# EasyEDA Pro project ProPrj_工训赛物料搬运主控_2025-03-02.epro, schematic 工训赛

## Sheets
1 主控无光耦
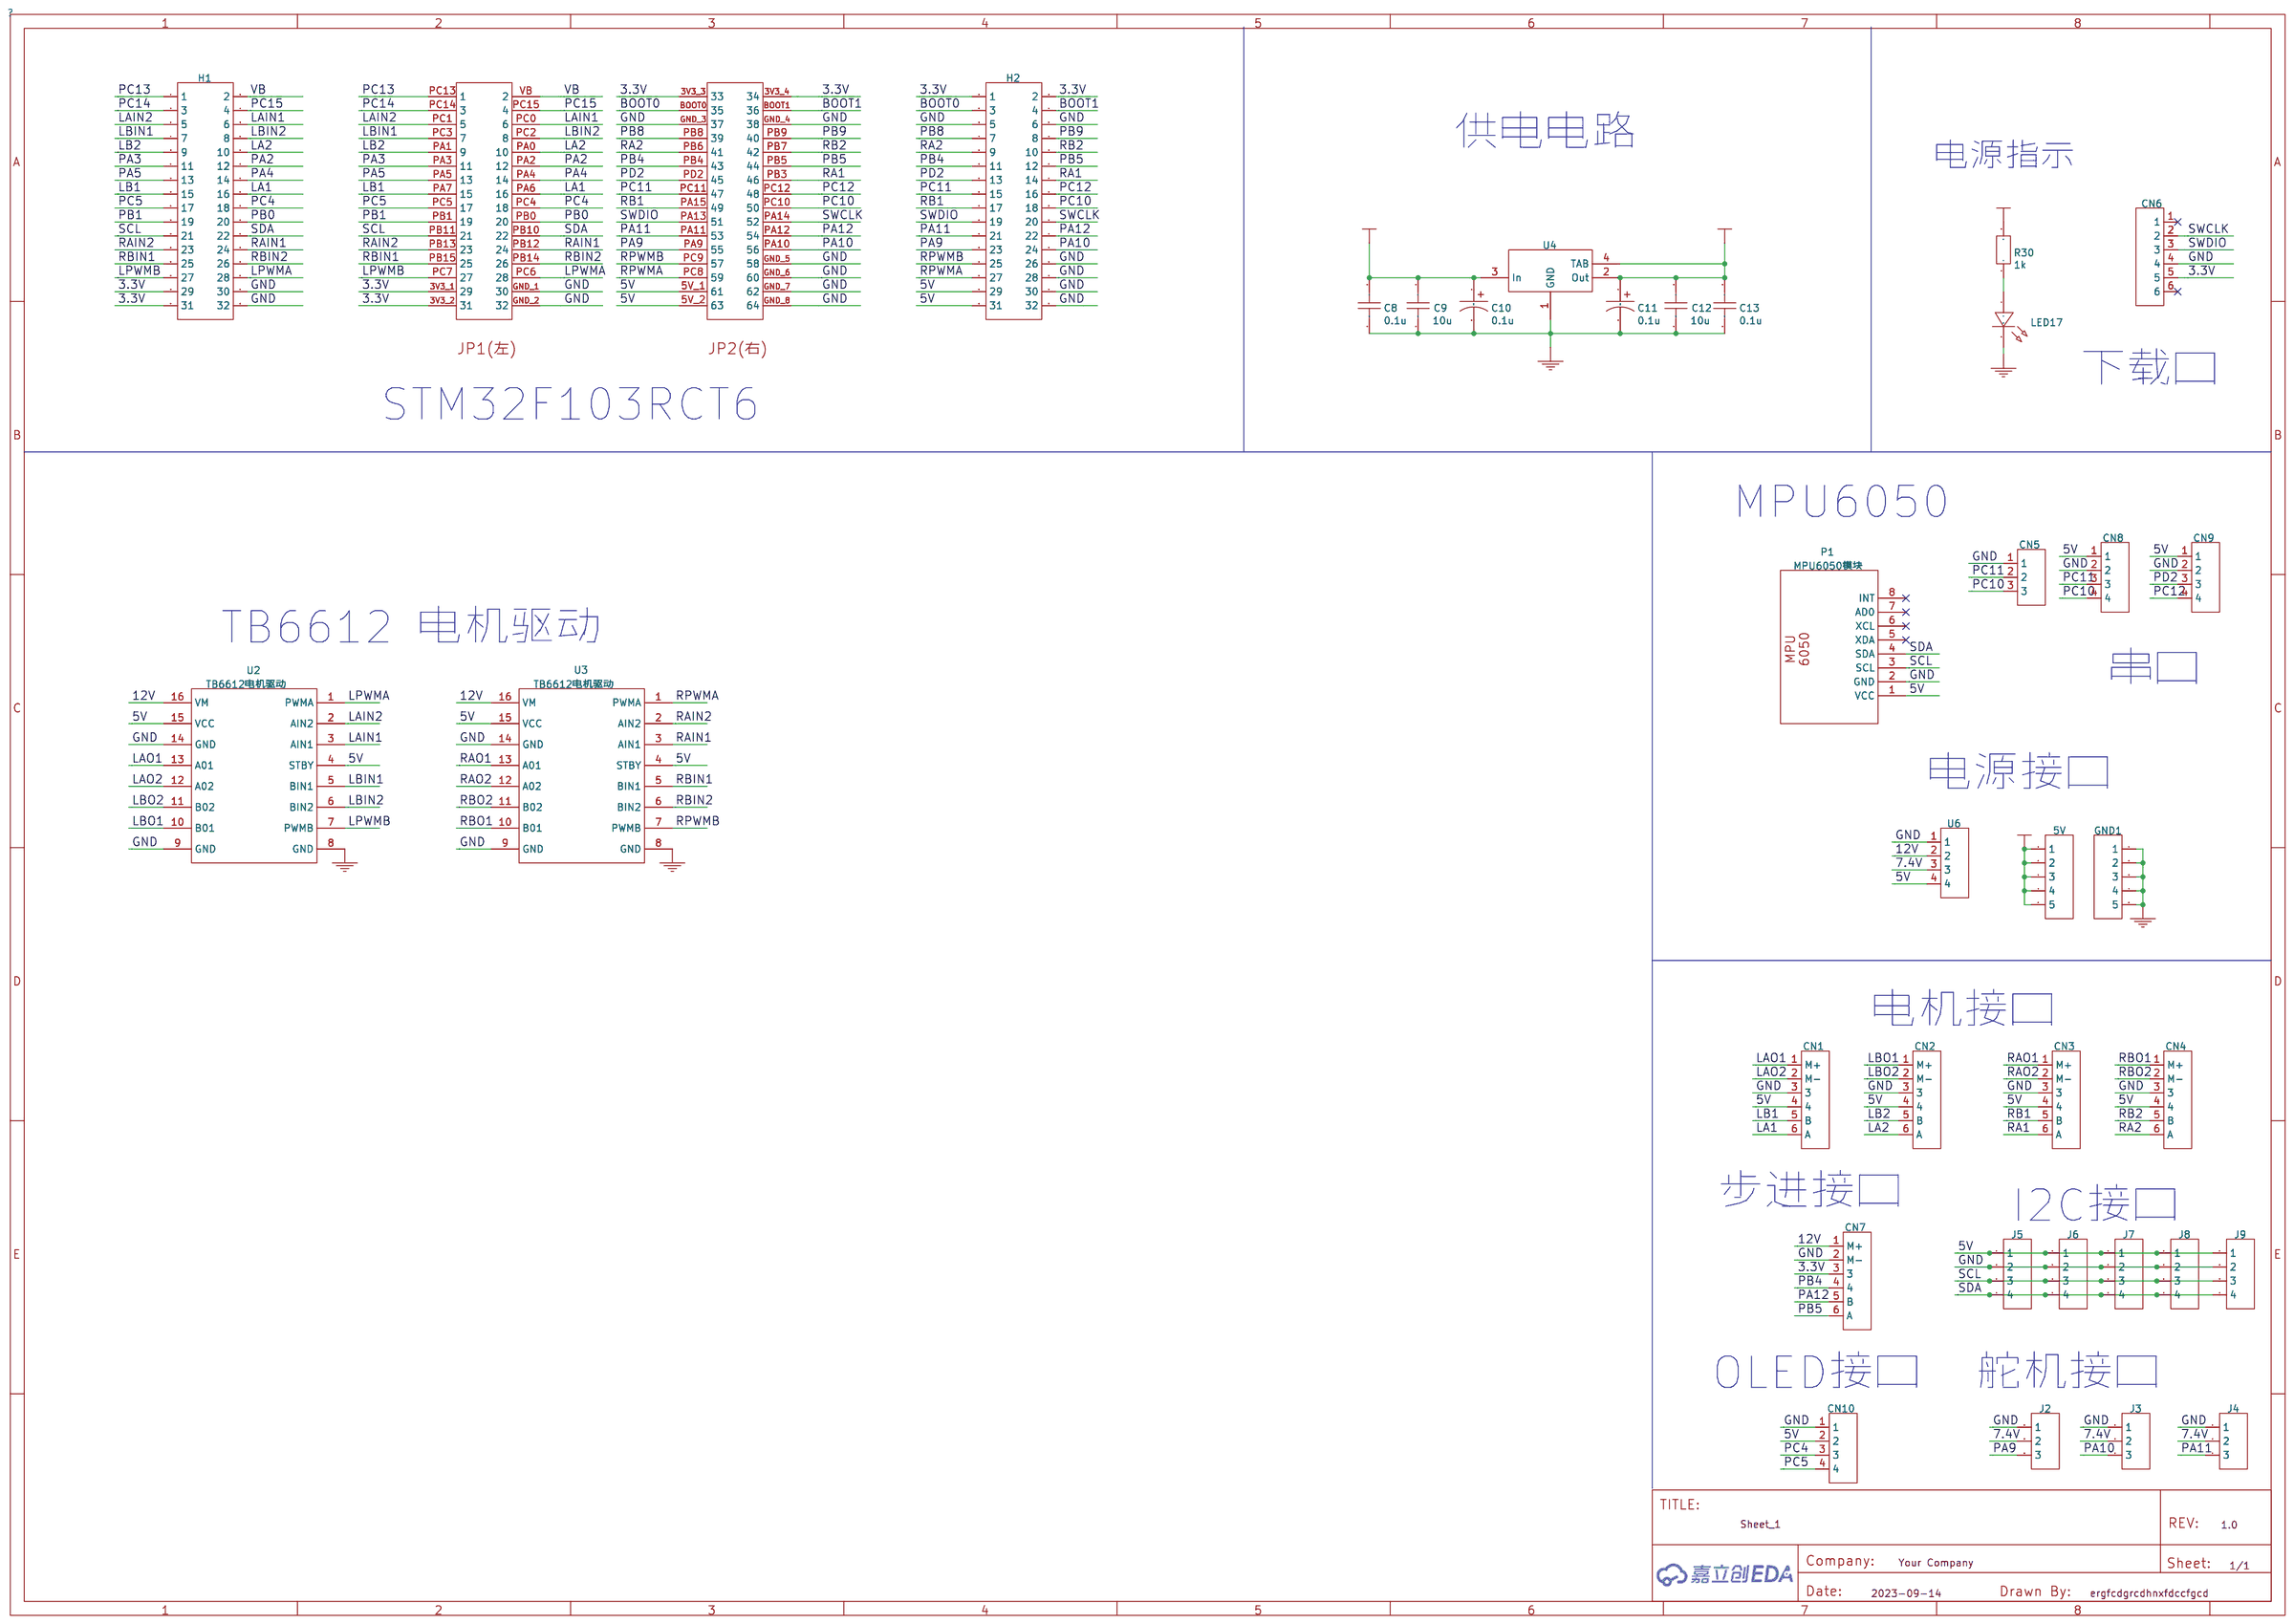
[diagram p0: 主控无光耦]
2 主控有光耦
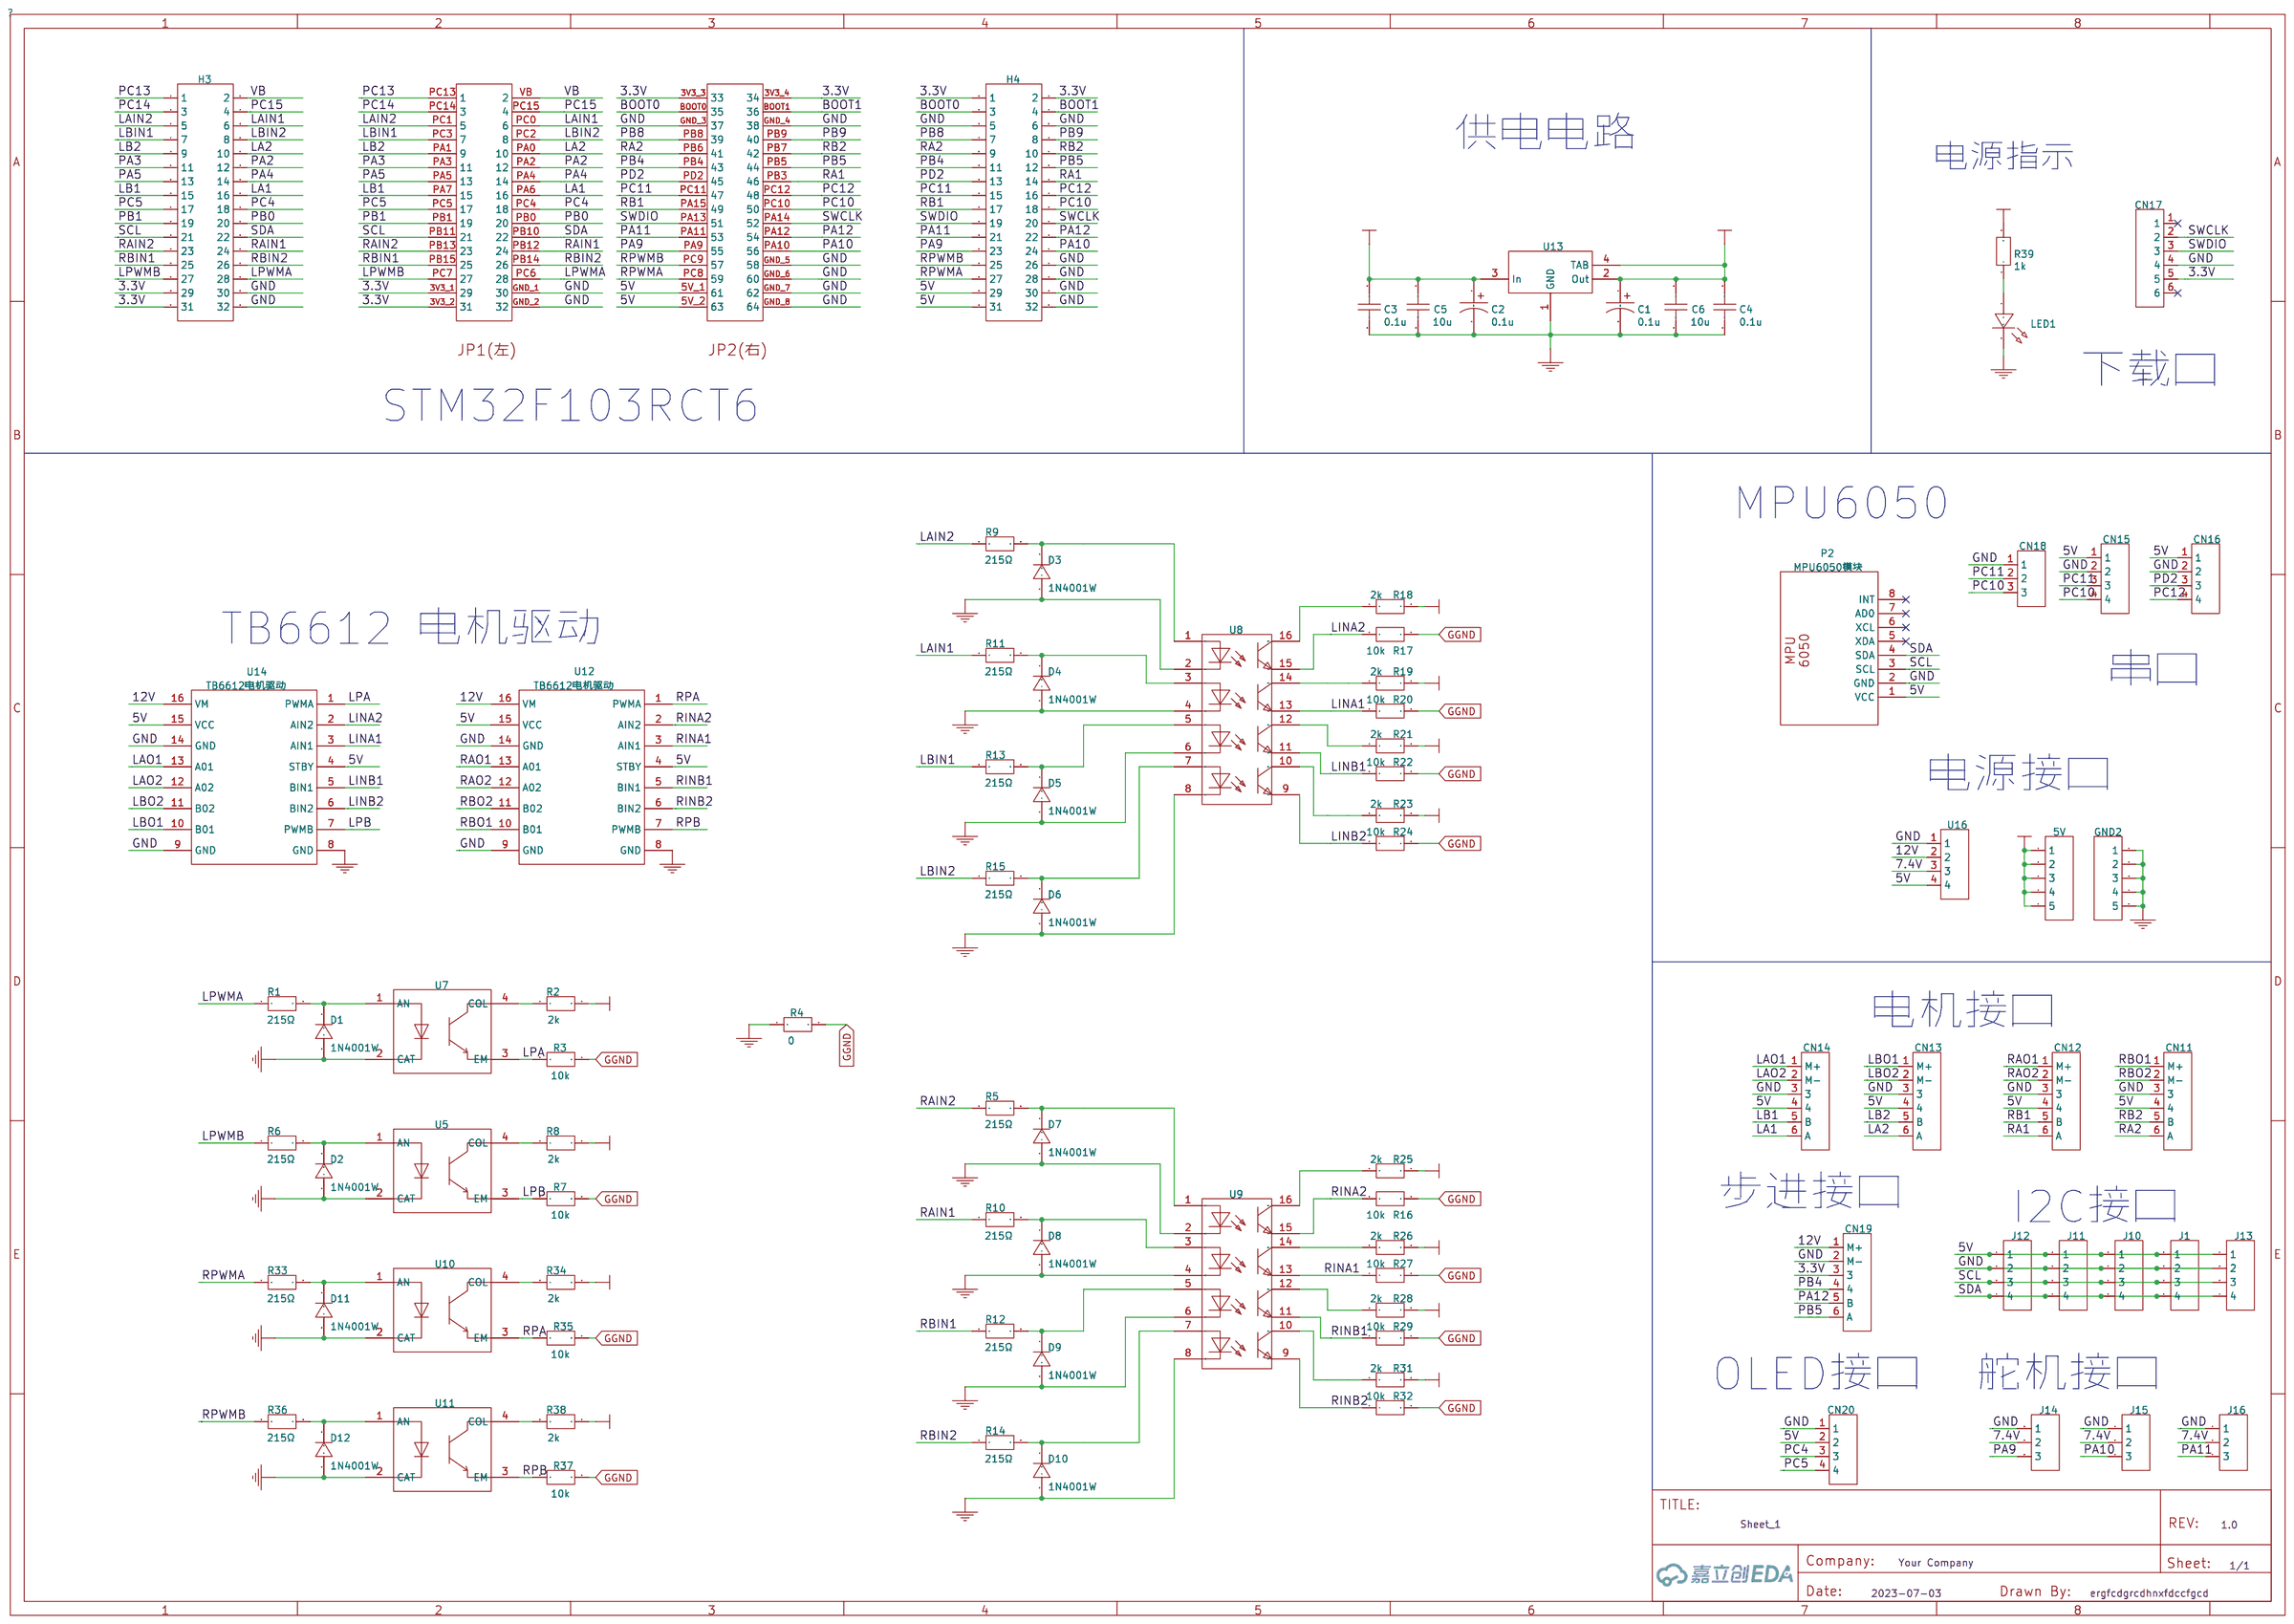
[diagram p1: 主控有光耦]
3 主控有光耦2.0
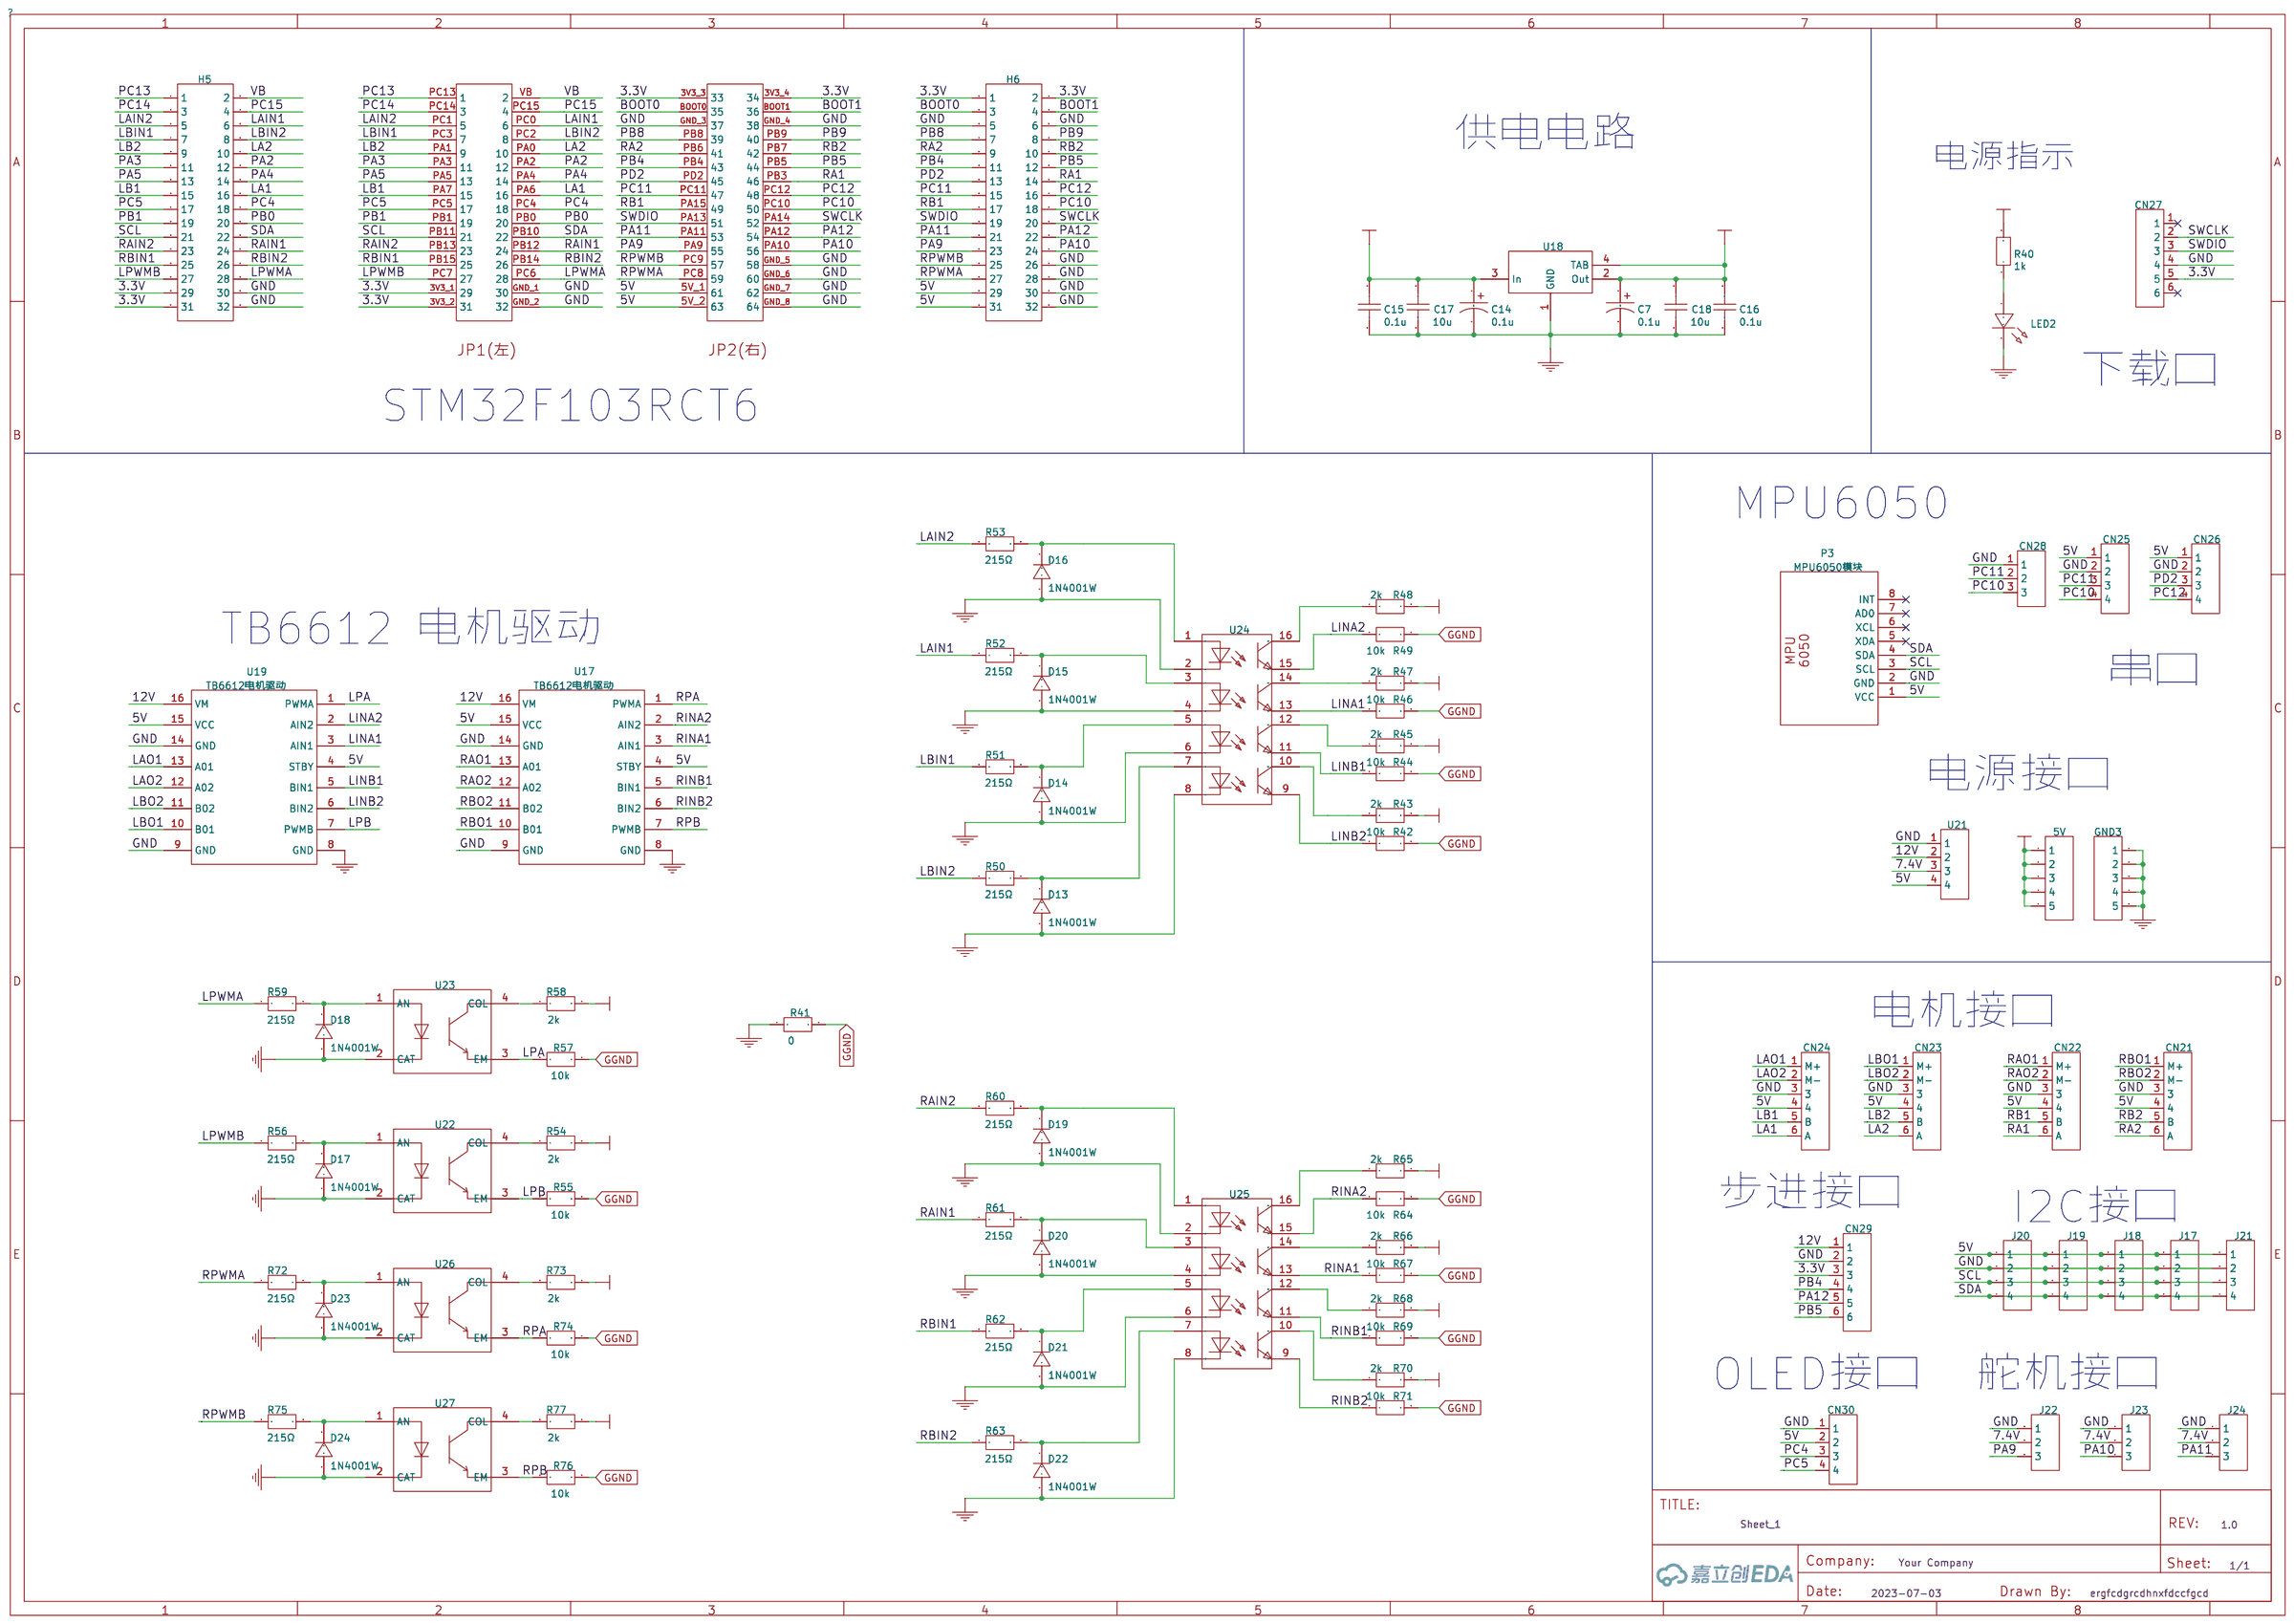
[diagram p2: 主控有光耦2.0]

## Parts
sheet 主控无光耦
5V  HDR-M-2.54_1x5  [HDR-M-2.54_1X5]
C8  0.1u  [C0805]
C9  10u  [C0805]
C10  0.1u  [CASE-A_3216]
C11  0.1u  [CASE-A_3216]
C12  10u  [C0805]
C13  0.1u  [C0805]
CN1  KH-PH-6P-W  [CONN-TH_6P-P2.00_KINGHELM_KH-PH-6P-W]
CN2  KH-PH-6P-W  [CONN-TH_6P-P2.00_KINGHELM_KH-PH-6P-W]
CN3  KH-PH-6P-W  [CONN-TH_6P-P2.00_KINGHELM_KH-PH-6P-W]
CN4  KH-PH-6P-W  [CONN-TH_6P-P2.00_KINGHELM_KH-PH-6P-W]
CN5  KH-PH-3P-Z  [CONN-TH_3P-P2.00_KINGHELM_KH-PH-3P-Z]
CN6  KH-PH-6P-W  [CONN-TH_6P-P2.00_KINGHELM_KH-PH-6P-W]
CN7  KH-PH-6P-W  [CONN-TH_6P-P2.00_KINGHELM_KH-PH-6P-W]
CN8  KH-PH-4P-Z  [CONN-TH_4P-P2.00_KINGHELM_KH-PH-4P-Z]
CN9  KH-PH-4P-Z  [CONN-TH_4P-P2.00_KINGHELM_KH-PH-4P-Z]
CN10  KH-PH-4P-W  [CONN-TH_4P-P2.00_KINGHELM_KH-PH-4P-W]
GND1  HDR-M-2.54_1x5  [HDR-M-2.54_1X5]
H1  HDR-F-2.54_2x16  [HDR-F-2.54_2X16]
H2  HDR-F-2.54_2x16  [HDR-F-2.54_2X16]
J2  HDR-M-2.54_1x3  [HDR-M-2.54_1X3]
J3  HDR-M-2.54_1x3  [HDR-M-2.54_1X3]
J4  HDR-M-2.54_1x3  [HDR-M-2.54_1X3]
J5  HDR-M-2.54_1x4  [HDR-M-2.54_1X4]
J6  HDR-M-2.54_1x4  [HDR-M-2.54_1X4]
J7  HDR-M-2.54_1x4  [HDR-M-2.54_1X4]
J8  HDR-M-2.54_1x4  [HDR-M-2.54_1X4]
J9  HDR-M-2.54_1x4  [HDR-M-2.54_1X4]
LED17  LED-0603_R  [LED0603_RED]
P1  MPU6050模块  [MPU6050模块]
R30  1k  [R0805]
U1  NO  [STM32F103RCT6最小系统]
U2  TB6612电机驱动  [TB6612电机驱动]
U3  TB6612电机驱动  [TB6612电机驱动]
U4  AMS1117-3.3  [SOT-223]
U6  DB125-2.54-4P-GN  [CONN-TH_DB125-2.54-4P-GN]
sheet 主控有光耦2.0
5V#3  HDR-M-2.54_1x5  [HDR-M-2.54_1X5]
C7  0.1u  [CASE-A_3216]
C14  0.1u  [CASE-A_3216]
C15  0.1u  [C0805]
C16  0.1u  [C0805]
C17  10u  [C0805]
C18  10u  [C0805]
CN21  KH-PH-6P-W  [CONN-TH_6P-P2.00_KINGHELM_KH-PH-6P-W]
CN22  KH-PH-6P-W  [CONN-TH_6P-P2.00_KINGHELM_KH-PH-6P-W]
CN23  KH-PH-6P-W  [CONN-TH_6P-P2.00_KINGHELM_KH-PH-6P-W]
CN24  KH-PH-6P-W  [CONN-TH_6P-P2.00_KINGHELM_KH-PH-6P-W]
CN25  KH-PH-4P-Z  [CONN-TH_4P-P2.00_KINGHELM_KH-PH-4P-Z]
CN26  KH-PH-4P-Z  [CONN-TH_4P-P2.00_KINGHELM_KH-PH-4P-Z]
CN27  KH-PH-6P-W  [CONN-TH_6P-P2.00_KINGHELM_KH-PH-6P-W]
CN28  KH-PH-3P-Z  [CONN-TH_3P-P2.00_KINGHELM_KH-PH-3P-Z]
CN29  KH-PH-6P-W  [CONN-TH_6P-P2.00_KINGHELM_KH-PH-6P-W]
CN30  KH-PH-4P-W  [CONN-TH_4P-P2.00_KINGHELM_KH-PH-4P-W]
D13  1N4001W  [SOD-123F_L2.8-W1.8-LS3.7-RD]
D14  1N4001W  [SOD-123F_L2.8-W1.8-LS3.7-RD]
D15  1N4001W  [SOD-123F_L2.8-W1.8-LS3.7-RD]
D16  1N4001W  [SOD-123F_L2.8-W1.8-LS3.7-RD]
D17  1N4001W  [SOD-123F_L2.8-W1.8-LS3.7-RD]
D18  1N4001W  [SOD-123F_L2.8-W1.8-LS3.7-RD]
D19  1N4001W  [SOD-123F_L2.8-W1.8-LS3.7-RD]
D20  1N4001W  [SOD-123F_L2.8-W1.8-LS3.7-RD]
D21  1N4001W  [SOD-123F_L2.8-W1.8-LS3.7-RD]
D22  1N4001W  [SOD-123F_L2.8-W1.8-LS3.7-RD]
D23  1N4001W  [SOD-123F_L2.8-W1.8-LS3.7-RD]
D24  1N4001W  [SOD-123F_L2.8-W1.8-LS3.7-RD]
GND3  HDR-M-2.54_1x5  [HDR-M-2.54_1X5]
H5  HDR-F-2.54_2x16  [HDR-F-2.54_2X16]
H6  HDR-F-2.54_2x16  [HDR-F-2.54_2X16]
J17  HDR-M-2.54_1x4  [HDR-M-2.54_1X4]
J18  HDR-M-2.54_1x4  [HDR-M-2.54_1X4]
J19  HDR-M-2.54_1x4  [HDR-M-2.54_1X4]
J20  HDR-M-2.54_1x4  [HDR-M-2.54_1X4]
J21  HDR-M-2.54_1x4  [HDR-M-2.54_1X4]
J22  HDR-M-2.54_1x3  [HDR-M-2.54_1X3]
J23  HDR-M-2.54_1x3  [HDR-M-2.54_1X3]
J24  HDR-M-2.54_1x3  [HDR-M-2.54_1X3]
LED2  LED-0603_R  [LED0603_RED]
P3  MPU6050模块  [MPU6050模块]
R40  1k  [R0805]
R41  0  [R0805]
R42  10k  [R0805]
R43  2k  [R0805]
R44  10k  [R0805]
R45  2k  [R0805]
R46  10k  [R0805]
R47  2k  [R0805]
R48  2k  [R0805]
R49  10k  [R0805]
R50  215Ω  [R0805]
R51  215Ω  [R0805]
R52  215Ω  [R0805]
R53  215Ω  [R0805]
R54  2k  [R0805]
R55  10k  [R0805]
R56  215Ω  [R0805]
R57  10k  [R0805]
R58  2k  [R0805]
R59  215Ω  [R0805]
R60  215Ω  [R0805]
R61  215Ω  [R0805]
R62  215Ω  [R0805]
R63  215Ω  [R0805]
R64  10k  [R0805]
R65  2k  [R0805]
R66  2k  [R0805]
R67  10k  [R0805]
R68  2k  [R0805]
R69  10k  [R0805]
R70  2k  [R0805]
R71  10k  [R0805]
R72  215Ω  [R0805]
R73  2k  [R0805]
R74  10k  [R0805]
R75  215Ω  [R0805]
R76  10k  [R0805]
R77  2k  [R0805]
U17  TB6612电机驱动  [TB6612电机驱动]
U18  AMS1117-3.3  [SOT-223]
U19  TB6612电机驱动  [TB6612电机驱动]
U20  NO  [STM32F103RCT6最小系统]
U21  DB125-2.54-4P-GN  [CONN-TH_DB125-2.54-4P-GN]
U22  TLP521-1XSM  [SMD-4_L4.6-W6.5-P2.54-LS10.2-BL]
U23  TLP521-1XSM  [SMD-4_L4.6-W6.5-P2.54-LS10.2-BL]
U24  TLP521-4XSM  [SMD-16_L20.0-W6.5-P2.54-LS10.2-BL]
U25  TLP521-4XSM  [SMD-16_L20.0-W6.5-P2.54-LS10.2-BL]
U26  TLP521-1XSM  [SMD-4_L4.6-W6.5-P2.54-LS10.2-BL]
U27  TLP521-1XSM  [SMD-4_L4.6-W6.5-P2.54-LS10.2-BL]
sheet 主控有光耦
5V#2  HDR-M-2.54_1x5  [HDR-M-2.54_1X5]
C1  0.1u  [CASE-A_3216]
C2  0.1u  [CASE-A_3216]
C3  0.1u  [C0805]
C4  0.1u  [C0805]
C5  10u  [C0805]
C6  10u  [C0805]
CN11  KH-PH-6P-W  [CONN-TH_6P-P2.00_KINGHELM_KH-PH-6P-W]
CN12  KH-PH-6P-W  [CONN-TH_6P-P2.00_KINGHELM_KH-PH-6P-W]
CN13  KH-PH-6P-W  [CONN-TH_6P-P2.00_KINGHELM_KH-PH-6P-W]
CN14  KH-PH-6P-W  [CONN-TH_6P-P2.00_KINGHELM_KH-PH-6P-W]
CN15  KH-PH-4P-Z  [CONN-TH_4P-P2.00_KINGHELM_KH-PH-4P-Z]
CN16  KH-PH-4P-Z  [CONN-TH_4P-P2.00_KINGHELM_KH-PH-4P-Z]
CN17  KH-PH-6P-W  [CONN-TH_6P-P2.00_KINGHELM_KH-PH-6P-W]
CN18  KH-PH-3P-Z  [CONN-TH_3P-P2.00_KINGHELM_KH-PH-3P-Z]
CN19  KH-PH-6P-W  [CONN-TH_6P-P2.00_KINGHELM_KH-PH-6P-W]
CN20  KH-PH-4P-W  [CONN-TH_4P-P2.00_KINGHELM_KH-PH-4P-W]
D1  1N4001W  [SOD-123F_L2.8-W1.8-LS3.7-RD]
D2  1N4001W  [SOD-123F_L2.8-W1.8-LS3.7-RD]
D3  1N4001W  [SOD-123F_L2.8-W1.8-LS3.7-RD]
D4  1N4001W  [SOD-123F_L2.8-W1.8-LS3.7-RD]
D5  1N4001W  [SOD-123F_L2.8-W1.8-LS3.7-RD]
D6  1N4001W  [SOD-123F_L2.8-W1.8-LS3.7-RD]
D7  1N4001W  [SOD-123F_L2.8-W1.8-LS3.7-RD]
D8  1N4001W  [SOD-123F_L2.8-W1.8-LS3.7-RD]
D9  1N4001W  [SOD-123F_L2.8-W1.8-LS3.7-RD]
D10  1N4001W  [SOD-123F_L2.8-W1.8-LS3.7-RD]
D11  1N4001W  [SOD-123F_L2.8-W1.8-LS3.7-RD]
D12  1N4001W  [SOD-123F_L2.8-W1.8-LS3.7-RD]
GND2  HDR-M-2.54_1x5  [HDR-M-2.54_1X5]
H3  HDR-F-2.54_2x16  [HDR-F-2.54_2X16]
H4  HDR-F-2.54_2x16  [HDR-F-2.54_2X16]
J1  HDR-M-2.54_1x4  [HDR-M-2.54_1X4]
J10  HDR-M-2.54_1x4  [HDR-M-2.54_1X4]
J11  HDR-M-2.54_1x4  [HDR-M-2.54_1X4]
J12  HDR-M-2.54_1x4  [HDR-M-2.54_1X4]
J13  HDR-M-2.54_1x4  [HDR-M-2.54_1X4]
J14  HDR-M-2.54_1x3  [HDR-M-2.54_1X3]
J15  HDR-M-2.54_1x3  [HDR-M-2.54_1X3]
J16  HDR-M-2.54_1x3  [HDR-M-2.54_1X3]
LED1  LED-0603_R  [LED0603_RED]
P2  MPU6050模块  [MPU6050模块]
R1  215Ω  [R0805]
R2  2k  [R0805]
R3  10k  [R0805]
R4  0  [R0805]
R5  215Ω  [R0805]
R6  215Ω  [R0805]
R7  10k  [R0805]
R8  2k  [R0805]
R9  215Ω  [R0805]
R10  215Ω  [R0805]
R11  215Ω  [R0805]
R12  215Ω  [R0805]
R13  215Ω  [R0805]
R14  215Ω  [R0805]
R15  215Ω  [R0805]
R16  10k  [R0805]
R17  10k  [R0805]
R18  2k  [R0805]
R19  2k  [R0805]
R20  10k  [R0805]
R21  2k  [R0805]
R22  10k  [R0805]
R23  2k  [R0805]
R24  10k  [R0805]
R25  2k  [R0805]
R26  2k  [R0805]
R27  10k  [R0805]
R28  2k  [R0805]
R29  10k  [R0805]
R31  2k  [R0805]
R32  10k  [R0805]
R33  215Ω  [R0805]
R34  2k  [R0805]
R35  10k  [R0805]
R36  215Ω  [R0805]
R37  10k  [R0805]
R38  2k  [R0805]
R39  1k  [R0805]
U5  TLP521-1XSM  [SMD-4_L4.6-W6.5-P2.54-LS10.2-BL]
U7  TLP521-1XSM  [SMD-4_L4.6-W6.5-P2.54-LS10.2-BL]
U8  TLP521-4XSM  [SMD-16_L20.0-W6.5-P2.54-LS10.2-BL]
U9  TLP521-4XSM  [SMD-16_L20.0-W6.5-P2.54-LS10.2-BL]
U10  TLP521-1XSM  [SMD-4_L4.6-W6.5-P2.54-LS10.2-BL]
U11  TLP521-1XSM  [SMD-4_L4.6-W6.5-P2.54-LS10.2-BL]
U12  TB6612电机驱动  [TB6612电机驱动]
U13  AMS1117-3.3  [SOT-223]
U14  TB6612电机驱动  [TB6612电机驱动]
U15  NO  [STM32F103RCT6最小系统]
U16  DB125-2.54-4P-GN  [CONN-TH_DB125-2.54-4P-GN]

## Library data of the parts
5V 5V#2 5V#3 GND1-GND3 = HDR-M-2.54_1x5: Supplier Part: C358687; Supplier: LCSC
C1-C4 C7 C8 C10 C11 C13-C16 = 0.1u
C5 C6 C9 C12 C17 C18 = 10u: Manufacturer Part: ?
CN1-CN4 CN11-CN14 CN21-CN24 = KH-PH-6P-W: Supplier: LCSC; Supplier Part: C2898958; Manufacturer: kinghelm(金航标); JLCPCB Part Class: Extended Part
CN5 CN18 CN28 = KH-PH-3P-Z: Supplier: LCSC; Supplier Part: C2898946; Manufacturer: kinghelm(金航标); JLCPCB Part Class: Extended Part; link: https://so.szlcsc.com/global.html?k=C2898946&ref=editor
CN6 CN7 CN17 CN19 CN27 CN29 = KH-PH-6P-W: Supplier: LCSC; Supplier Part: C2898958; Manufacturer: kinghelm(金航标); JLCPCB Part Class: Extended Part; link: https://so.szlcsc.com/global.html?k=C2898958&ref=editor
CN8 CN9 CN15 CN16 CN25 CN26 = KH-PH-4P-Z: Supplier: LCSC; Supplier Part: C2898947; Manufacturer: kinghelm(金航标); JLCPCB Part Class: Extended Part; link: https://so.szlcsc.com/global.html?k=C2898947&ref=editor
CN10 CN20 CN30 = KH-PH-4P-W: Supplier: LCSC; Supplier Part: C2898956; Manufacturer: kinghelm(金航标); JLCPCB Part Class: Extended Part; link: https://so.szlcsc.com/global.html?k=C2898956&ref=editor
H1-H6 = HDR-F-2.54_2x16: Supplier Part: C124382; Supplier: LCSC
J2-J4 J14-J16 J22-J24 = HDR-M-2.54_1x3: Supplier Part: C180248; Supplier: LCSC
J1 J5-J13 J17-J21 = HDR-M-2.54_1x4: Supplier Part: C124378; Supplier: LCSC
LED1 LED2 LED17 = LED-0603_R: Manufacturer: EVERLIGHT(台湾亿光); Manufacturer Part: 19-217/R6C-AL1M2VY/3T; Supplier Part: C72044; Supplier: LCSC
P1-P3 = MPU6050模块: Supplier: LCSC
R30 R39 R40 = 1k
U1 U15 U20 = NO: Manufacturer: 信泰微电子; Manufacturer Part: STM32F103RCT6; Supplier: 信泰微电子
U2 U3 U12 U14 U17 U19 = TB6612电机驱动: Supplier: LCSC
U4 U13 U18 = AMS1117-3.3: Supplier: LCSC; Manufacturer: AMS; image: //image.lceda.cn/szlcsc/C6186.jpg; Supplier Part: C6186
U6 U16 U21 = DB125-2.54-4P-GN: Supplier: LCSC; Supplier Part: C918122; Manufacturer: DIBO(地博电气); Manufacturer Part: DB125-2.54-4P-GN-S; JLCPCB Part Class: Extended Part; link: https://so.szlcsc.com/global.html?k=C918122&ref=editor
D1-D24 = 1N4001W: Supplier Part: C162732; Supplier: LCSC; Manufacturer: 晶导微电子; JLCPCB Part Class: Extended Part; link: https://so.szlcsc.com/global.html?k=C162732&ref=editor
R4 R41 = 0
R3 R7 R16 R17 R20 R22 R24 R27 R29 R32 R35 R37 R42 R44 R46 R49 R55 R57 R64 R67 R69 R71 R74 R76 = 10k
R2 R8 R18 R19 R21 R23 R25 R26 R28 R31 R34 R38 R43 R45 R47 R48 R54 R58 R65 R66 R68 R70 R73 R77 = 2k
R1 R5 R6 R9-R15 R33 R36 R50-R53 R56 R59-R63 R72 R75 = 215Ω
U5 U7 U10 U11 U22 U23 U26 U27 = TLP521-1XSM: Supplier: LCSC; Manufacturer: ISOCOM(英国安数光); Supplier Part: C83157; JLCPCB Part Class: Extended Part; link: https://so.szlcsc.com/global.html?k=C83157&ref=editor
U8 U9 U24 U25 = TLP521-4XSM: Supplier: LCSC; Manufacturer: ISOCOM(英国安数光); Manufacturer Part: TLP521-4XGBSM; Supplier Part: C83832; JLCPCB Part Class: Extended Part; link: https://so.szlcsc.com/global.html?k=C83832&ref=editor

## Nets
3.3V: C1.1 C4.2 C6.2 C7.1 C11.1 C12.2 C13.2 C16.2 C18.2 CN6.5 CN7.3 CN17.5 CN19.3 CN27.5 CN29.3 H1.29 H1.31 H2.1 H2.2 H3.29 H3.31 H4.1 H4.2 H5.29 H5.31 H6.1 H6.2 R30.2 R39.2 R40.2 U1.3V3_1(29) U1.3V3_2(31) U1.3V3_3(33) U1.3V3_4(34) U4.2(Out) U4.4(TAB) U13.2(Out) U13.4(TAB) U15.3V3_1(29) U15.3V3_2(31) U15.3V3_3(33) U15.3V3_4(34) U18.2(Out) U18.4(TAB) U20.3V3_1(29) U20.3V3_2(31) U20.3V3_3(33) U20.3V3_4(34)
5V: 5V.1 5V.2 5V.3 5V.4 5V.5 5V#2.1 5V#2.2 5V#2.3 5V#2.4 5V#2.5 5V#3.1 5V#3.2 5V#3.3 5V#3.4 5V#3.5 C2.1 C3.2 C5.2 C8.2 C9.2 C10.1 C14.1 C15.2 C17.2 CN1.4 CN2.4 CN3.4 CN4.4 CN8.1 CN9.1 CN10.2 CN11.4 CN12.4 CN13.4 CN14.4 CN15.1 CN16.1 CN20.2 CN21.4 CN22.4 CN23.4 CN24.4 CN25.1 CN26.1 CN30.2 H2.29 H2.31 H4.29 H4.31 H6.29 H6.31 J1.1 J5.1 J6.1 J7.1 J8.1 J9.1 J10.1 J11.1 J12.1 J13.1 J17.1 J18.1 J19.1 J20.1 J21.1 P1.1(VCC) P2.1(VCC) P3.1(VCC) R2.2 R8.2 R18.2 R19.2 R21.2 R23.2 R25.2 R26.2 R28.2 R31.2 R34.2 R38.2 R43.2 R45.2 R47.2 R48.2 R54.2 R58.2 R65.2 R66.2 R68.2 R70.2 R73.2 R77.2 U1.5V_1(61) U1.5V_2(63) U2.4(STBY) U2.15(VCC) U3.4(STBY) U3.15(VCC) U4.3(In) U6.4 U12.4(STBY) U12.15(VCC) U13.3(In) U14.4(STBY) U14.15(VCC) U15.5V_1(61) U15.5V_2(63) U16.4 U17.4(STBY) U17.15(VCC) U18.3(In) U19.4(STBY) U19.15(VCC) U20.5V_1(61) U20.5V_2(63) U21.4
7.4V: J2.2 J3.2 J4.2 J14.2 J15.2 J16.2 J22.2 J23.2 J24.2 U6.3 U16.3 U21.3
12V: CN7.1 CN19.1 CN29.1 U2.16(VM) U3.16(VM) U6.2 U12.16(VM) U14.16(VM) U16.2 U17.16(VM) U19.16(VM) U21.2
GND: C1.2 C2.2 C3.1 C4.1 C5.1 C6.1 C7.2 C8.1 C9.1 C10.2 C11.2 C12.1 C13.1 C14.2 C15.1 C16.1 C17.1 C18.1 CN1.3 CN2.3 CN3.3 CN4.3 CN5.1 CN6.4 CN7.2 CN8.2 CN9.2 CN10.1 CN11.3 CN12.3 CN13.3 CN14.3 CN15.2 CN16.2 CN17.4 CN18.1 CN19.2 CN20.1 CN21.3 CN22.3 CN23.3 CN24.3 CN25.2 CN26.2 CN27.4 CN28.1 CN29.2 CN30.1 D1.2(A) D2.2(A) D3.2(A) D4.2(A) D5.2(A) D6.2(A) D7.2(A) D8.2(A) D9.2(A) D10.2(A) D11.2(A) D12.2(A) D13.2(A) D14.2(A) D15.2(A) D16.2(A) D17.2(A) D18.2(A) D19.2(A) D20.2(A) D21.2(A) D22.2(A) D23.2(A) D24.2(A) GND1.1 GND1.2 GND1.3 GND1.4 GND1.5 GND2.1 GND2.2 GND2.3 GND2.4 GND2.5 GND3.1 GND3.2 GND3.3 GND3.4 GND3.5 H1.30 H1.32 H2.5 H2.6 H2.26 H2.28 H2.30 H2.32 H3.30 H3.32 H4.5 H4.6 H4.26 H4.28 H4.30 H4.32 H5.30 H5.32 H6.5 H6.6 H6.26 H6.28 H6.30 H6.32 J1.2 J2.1 J3.1 J4.1 J5.2 J6.2 J7.2 J8.2 J9.2 J10.2 J11.2 J12.2 J13.2 J14.1 J15.1 J16.1 J17.2 J18.2 J19.2 J20.2 J21.2 J22.1 J23.1 J24.1 LED1.2 LED2.2 LED17.2 P1.2(GND) P2.2(GND) P3.2(GND) R4.1 R41.1 U1.GND_1(30) U1.GND_2(32) U1.GND_3(37) U1.GND_4(38) U1.GND_5(58) U1.GND_6(60) U1.GND_7(62) U1.GND_8(64) U2.8(GND) U2.9(GND) U2.14(GND) U3.8(GND) U3.9(GND) U3.14(GND) U4.1(GND) U5.2(CAT) U6.1 U7.2(CAT) U8.2(CAT) U8.4(CAT) U8.6(CAT) U8.8(CAT) U9.2(CAT) U9.4(CAT) U9.6(CAT) U9.8(CAT) U10.2(CAT) U11.2(CAT) U12.8(GND) U12.9(GND) U12.14(GND) U13.1(GND) U14.8(GND) U14.9(GND) U14.14(GND) U15.GND_1(30) U15.GND_2(32) U15.GND_3(37) U15.GND_4(38) U15.GND_5(58) U15.GND_6(60) U15.GND_7(62) U15.GND_8(64) U16.1 U17.8(GND) U17.9(GND) U17.14(GND) U18.1(GND) U19.8(GND) U19.9(GND) U19.14(GND) U20.GND_1(30) U20.GND_2(32) U20.GND_3(37) U20.GND_4(38) U20.GND_5(58) U20.GND_6(60) U20.GND_7(62) U20.GND_8(64) U21.1 U22.2(CAT) U23.2(CAT) U24.2(CAT) U24.4(CAT) U24.6(CAT) U24.8(CAT) U25.2(CAT) U25.4(CAT) U25.6(CAT) U25.8(CAT) U26.2(CAT) U27.2(CAT)
BOOT0: H2.3 H4.3 H6.3 U1.BOOT0(35) U15.BOOT0(35) U20.BOOT0(35)
BOOT1: H2.4 H4.4 H6.4 U1.BOOT1(36) U15.BOOT1(36) U20.BOOT1(36)
GGND: R3.2 R4.2 R7.2 R16.2 R17.2 R20.2 R22.2 R24.2 R27.2 R29.2 R32.2 R35.2 R37.2 R41.2 R42.2 R44.2 R46.2 R49.2 R55.2 R57.2 R64.2 R67.2 R69.2 R71.2 R74.2 R76.2
LA1: CN1.6(A) CN14.6(A) CN24.6(A) H1.16 H3.16 H5.16 U1.PA6(16) U15.PA6(16) U20.PA6(16)
LA2: CN2.6(A) CN13.6(A) CN23.6(A) H1.10 H3.10 H5.10 U1.PA0(10) U15.PA0(10) U20.PA0(10)
LAIN1: H1.6 H3.6 H5.6 R11.1 R52.1 U1.PC0(6) U2.3(AIN1) U15.PC0(6) U20.PC0(6)
LAIN2: H1.5 H3.5 H5.5 R9.1 R53.1 U1.PC1(5) U2.2(AIN2) U15.PC1(5) U20.PC1(5)
LAO1: CN1.1(M+) CN14.1(M+) CN24.1(M+) U2.13(A01) U14.13(A01) U19.13(A01)
LAO2: CN1.2(M-) CN14.2(M-) CN24.2(M-) U2.12(A02) U14.12(A02) U19.12(A02)
LB1: CN1.5(B) CN14.5(B) CN24.5(B) H1.15 H3.15 H5.15 U1.PA7(15) U15.PA7(15) U20.PA7(15)
LB2: CN2.5(B) CN13.5(B) CN23.5(B) H1.9 H3.9 H5.9 U1.PA1(9) U15.PA1(9) U20.PA1(9)
LBIN1: H1.7 H3.7 H5.7 R13.1 R51.1 U1.PC3(7) U2.5(BIN1) U15.PC3(7) U20.PC3(7)
LBIN2: H1.8 H3.8 H5.8 R15.1 R50.1 U1.PC2(8) U2.6(BIN2) U15.PC2(8) U20.PC2(8)
LBO1: CN2.1(M+) CN13.1(M+) CN23.1(M+) U2.10(B01) U14.10(B01) U19.10(B01)
LBO2: CN2.2(M-) CN13.2(M-) CN23.2(M-) U2.11(B02) U14.11(B02) U19.11(B02)
LINA1: R20.1 R46.1 U8.13(EM) U14.3(AIN1) U19.3(AIN1) U24.13(EM)
LINA2: R17.1 R49.1 U8.15(EM) U14.2(AIN2) U19.2(AIN2) U24.15(EM)
LINB1: R22.1 R44.1 U8.11(EM) U14.5(BIN1) U19.5(BIN1) U24.11(EM)
LINB2: R24.1 R42.1 U8.9(EM) U14.6(BIN2) U19.6(BIN2) U24.9(EM)
LPA: R3.1 R57.1 U7.3(EM) U14.1(PWMA) U19.1(PWMA) U23.3(EM)
LPB: R7.1 R55.1 U5.3(EM) U14.7(PWMB) U19.7(PWMB) U22.3(EM)
LPWMA: H1.28 H3.28 H5.28 R1.1 R59.1 U1.PC6(28) U2.1(PWMA) U15.PC6(28) U20.PC6(28)
LPWMB: H1.27 H3.27 H5.27 R6.1 R56.1 U1.PC7(27) U2.7(PWMB) U15.PC7(27) U20.PC7(27)
PA2: H1.12 H3.12 H5.12 U1.PA2(12) U15.PA2(12) U20.PA2(12)
PA3: H1.11 H3.11 H5.11 U1.PA3(11) U15.PA3(11) U20.PA3(11)
PA4: H1.14 H3.14 H5.14 U1.PA4(14) U15.PA4(14) U20.PA4(14)
PA5: H1.13 H3.13 H5.13 U1.PA5(13) U15.PA5(13) U20.PA5(13)
PA9: H2.23 H4.23 H6.23 J2.3 J14.3 J22.3 U1.PA9(55) U15.PA9(55) U20.PA9(55)
PA10: H2.24 H4.24 H6.24 J3.3 J15.3 J23.3 U1.PA10(56) U15.PA10(56) U20.PA10(56)
PA11: H2.21 H4.21 H6.21 J4.3 J16.3 J24.3 U1.PA11(53) U15.PA11(53) U20.PA11(53)
PA12: CN7.5 CN19.5 CN29.5 H2.22 H4.22 H6.22 U1.PA12(54) U15.PA12(54) U20.PA12(54)
PB0: H1.20 H3.20 H5.20 U1.PB0(20) U15.PB0(20) U20.PB0(20)
PB1: H1.19 H3.19 H5.19 U1.PB1(19) U15.PB1(19) U20.PB1(19)
PB4: CN7.4 CN19.4 CN29.4 H2.11 H4.11 H6.11 U1.PB4(43) U15.PB4(43) U20.PB4(43)
PB5: CN7.6 CN19.6 CN29.6 H2.12 H4.12 H6.12 U1.PB5(44) U15.PB5(44) U20.PB5(44)
PB8: H2.7 H4.7 H6.7 U1.PB8(39) U15.PB8(39) U20.PB8(39)
PB9: H2.8 H4.8 H6.8 U1.PB9(40) U15.PB9(40) U20.PB9(40)
PC4: CN10.3 CN20.3 CN30.3 H1.18 H3.18 H5.18 U1.PC4(18) U15.PC4(18) U20.PC4(18)
PC5: CN10.4 CN20.4 CN30.4 H1.17 H3.17 H5.17 U1.PC5(17) U15.PC5(17) U20.PC5(17)
PC10: CN5.3 CN8.4 CN15.4 CN18.3 CN25.4 CN28.3 H2.18 H4.18 H6.18 U1.PC10(50) U15.PC10(50) U20.PC10(50)
PC11: CN5.2 CN8.3 CN15.3 CN18.2 CN25.3 CN28.2 H2.15 H4.15 H6.15 U1.PC11(47) U15.PC11(47) U20.PC11(47)
PC12: CN9.4 CN16.4 CN26.4 H2.16 H4.16 H6.16 U1.PC12(48) U15.PC12(48) U20.PC12(48)
PC13: H1.1 H3.1 H5.1 U1.PC13(1) U15.PC13(1) U20.PC13(1)
PC14: H1.3 H3.3 H5.3 U1.PC14(3) U15.PC14(3) U20.PC14(3)
PC15: H1.4 H3.4 H5.4 U1.PC15(4) U15.PC15(4) U20.PC15(4)
PD2: CN9.3 CN16.3 CN26.3 H2.13 H4.13 H6.13 U1.PD2(45) U15.PD2(45) U20.PD2(45)
RA1: CN3.6(A) CN12.6(A) CN22.6(A) H2.14 H4.14 H6.14 U1.PB3(46) U15.PB3(46) U20.PB3(46)
RA2: CN4.6(A) CN11.6(A) CN21.6(A) H2.9 H4.9 H6.9 U1.PB6(41) U15.PB6(41) U20.PB6(41)
RAIN1: H1.24 H3.24 H5.24 R10.1 R61.1 U1.PB12(24) U3.3(AIN1) U15.PB12(24) U20.PB12(24)
RAIN2: H1.23 H3.23 H5.23 R5.1 R60.1 U1.PB13(23) U3.2(AIN2) U15.PB13(23) U20.PB13(23)
RAO1: CN3.1(M+) CN12.1(M+) CN22.1(M+) U3.13(A01) U12.13(A01) U17.13(A01)
RAO2: CN3.2(M-) CN12.2(M-) CN22.2(M-) U3.12(A02) U12.12(A02) U17.12(A02)
RB1: CN3.5(B) CN12.5(B) CN22.5(B) H2.17 H4.17 H6.17 U1.PA15(49) U15.PA15(49) U20.PA15(49)
RB2: CN4.5(B) CN11.5(B) CN21.5(B) H2.10 H4.10 H6.10 U1.PB7(42) U15.PB7(42) U20.PB7(42)
RBIN1: H1.25 H3.25 H5.25 R12.1 R62.1 U1.PB15(25) U3.5(BIN1) U15.PB15(25) U20.PB15(25)
RBIN2: H1.26 H3.26 H5.26 R14.1 R63.1 U1.PB14(26) U3.6(BIN2) U15.PB14(26) U20.PB14(26)
RBO1: CN4.1(M+) CN11.1(M+) CN21.1(M+) U3.10(B01) U12.10(B01) U17.10(B01)
RBO2: CN4.2(M-) CN11.2(M-) CN21.2(M-) U3.11(B02) U12.11(B02) U17.11(B02)
RINA1: R27.1 R67.1 U9.13(EM) U12.3(AIN1) U17.3(AIN1) U25.13(EM)
RINA2: R16.1 R64.1 U9.15(EM) U12.2(AIN2) U17.2(AIN2) U25.15(EM)
RINB1: R29.1 R69.1 U9.11(EM) U12.5(BIN1) U17.5(BIN1) U25.11(EM)
RINB2: R32.1 R71.1 U9.9(EM) U12.6(BIN2) U17.6(BIN2) U25.9(EM)
RPA: R35.1 R74.1 U10.3(EM) U12.1(PWMA) U17.1(PWMA) U26.3(EM)
RPB: R37.1 R76.1 U11.3(EM) U12.7(PWMB) U17.7(PWMB) U27.3(EM)
RPWMA: H2.27 H4.27 H6.27 R33.1 R72.1 U1.PC8(59) U3.1(PWMA) U15.PC8(59) U20.PC8(59)
RPWMB: H2.25 H4.25 H6.25 R36.1 R75.1 U1.PC9(57) U3.7(PWMB) U15.PC9(57) U20.PC9(57)
SCL: H1.21 H3.21 H5.21 J1.3 J5.3 J6.3 J7.3 J8.3 J9.3 J10.3 J11.3 J12.3 J13.3 J17.3 J18.3 J19.3 J20.3 J21.3 P1.3(SCL) P2.3(SCL) P3.3(SCL) U1.PB11(21) U15.PB11(21) U20.PB11(21)
SDA: H1.22 H3.22 H5.22 J1.4 J5.4 J6.4 J7.4 J8.4 J9.4 J10.4 J11.4 J12.4 J13.4 J17.4 J18.4 J19.4 J20.4 J21.4 P1.4(SDA) P2.4(SDA) P3.4(SDA) U1.PB10(22) U15.PB10(22) U20.PB10(22)
SWCLK: CN6.2 CN17.2 CN27.2 H2.20 H4.20 H6.20 U1.PA14(52) U15.PA14(52) U20.PA14(52)
SWDIO: CN6.3 CN17.3 CN27.3 H2.19 H4.19 H6.19 U1.PA13(51) U15.PA13(51) U20.PA13(51)
VB: H1.2 H3.2 H5.2 U1.VB(2) U15.VB(2) U20.VB(2)
D1_1: D1.1(C) R1.2 U7.1(AN)
D3_1: D3.1(C) R9.2 U8.1(AN)
D4_1: D4.1(C) R11.2 U8.3(AN)
D5_1: D5.1(C) R13.2 U8.5(AN)
D6_1: D6.1(C) R15.2 U8.7(AN)
LED17_1: LED17.1 R30.1
Net-(D13-1): D13.1(C) R50.2 U24.7(AN)
Net-(D14-1): D14.1(C) R51.2 U24.5(AN)
Net-(D15-1): D15.1(C) R52.2 U24.3(AN)
Net-(D16-1): D16.1(C) R53.2 U24.1(AN)
Net-(D17-1): D17.1(C) R56.2 U22.1(AN)
Net-(D18-1): D18.1(C) R59.2 U23.1(AN)
Net-(D19-1): D19.1(C) R60.2 U25.1(AN)
Net-(D20-1): D20.1(C) R61.2 U25.3(AN)
Net-(D21-1): D21.1(C) R62.2 U25.5(AN)
Net-(D22-1): D22.1(C) R63.2 U25.7(AN)
Net-(D23-1): D23.1(C) R72.2 U26.1(AN)
Net-(D24-1): D24.1(C) R75.2 U27.1(AN)
Net-(LED1-1): LED1.1 R39.1
Net-(LED2-1): LED2.1 R40.1
Net-(R43-1): R43.1 U24.10(COL)
Net-(R45-1): R45.1 U24.12(COL)
Net-(R47-1): R47.1 U24.14(COL)
Net-(R48-1): R48.1 U24.16(COL)
Net-(R54-1): R54.1 U22.4(COL)
Net-(R58-1): R58.1 U23.4(COL)
Net-(R65-1): R65.1 U25.16(COL)
Net-(R66-1): R66.1 U25.14(COL)
Net-(R68-1): R68.1 U25.12(COL)
Net-(R70-1): R70.1 U25.10(COL)
Net-(R73-1): R73.1 U26.4(COL)
Net-(R77-1): R77.1 U27.4(COL)
R2_1: R2.1 U7.4(COL)
R6_2: D2.1(C) R6.2 U5.1(AN)
R8_1: R8.1 U5.4(COL)
R18_1: R18.1 U8.16(COL)
R19_1: R19.1 U8.14(COL)
R21_1: R21.1 U8.12(COL)
R23_1: R23.1 U8.10(COL)
U9_1: D7.1(C) R5.2 U9.1(AN)
U9_3: D8.1(C) R10.2 U9.3(AN)
U9_5: D9.1(C) R12.2 U9.5(AN)
U9_7: D10.1(C) R14.2 U9.7(AN)
U9_10: R31.1 U9.10(COL)
U9_12: R28.1 U9.12(COL)
U9_14: R26.1 U9.14(COL)
U9_16: R25.1 U9.16(COL)
U10_1: D11.1(C) R33.2 U10.1(AN)
U10_4: R34.1 U10.4(COL)
U11_1: D12.1(C) R36.2 U11.1(AN)
U11_4: R38.1 U11.4(COL)

Not connected (* = marked no-connect by the designer): CN6 1* 6*; CN17 1* 6*; CN27 1* 6*; P1 5(XDA)* 6(XCL)* 7(AD0)* 8(INT)*; P2 5(XDA)* 6(XCL)* 7(AD0)* 8(INT)*; P3 5(XDA)* 6(XCL)* 7(AD0)* 8(INT)*

## Notes on the sheets
sheet 1
- 供电电路
- 电源指示
- 下载口
- STM32F103RCT6
- MPU6050
- TB6612 电机驱动
- 串口
- 电源接口
- 电机接口
- 步进接口
- I2C接口
- OLED接口
- 舵机接口
sheet 2
- 供电电路
- 电源指示
- 下载口
- STM32F103RCT6
- MPU6050
- TB6612 电机驱动
- 串口
- 电源接口
- 电机接口
- 步进接口
- I2C接口
- OLED接口
- 舵机接口
sheet 3
- 供电电路
- 电源指示
- 下载口
- STM32F103RCT6
- MPU6050
- TB6612 电机驱动
- 串口
- 电源接口
- 电机接口
- 步进接口
- I2C接口
- OLED接口
- 舵机接口
